# EAGLE design DACBRD (EAGLE 5.07)
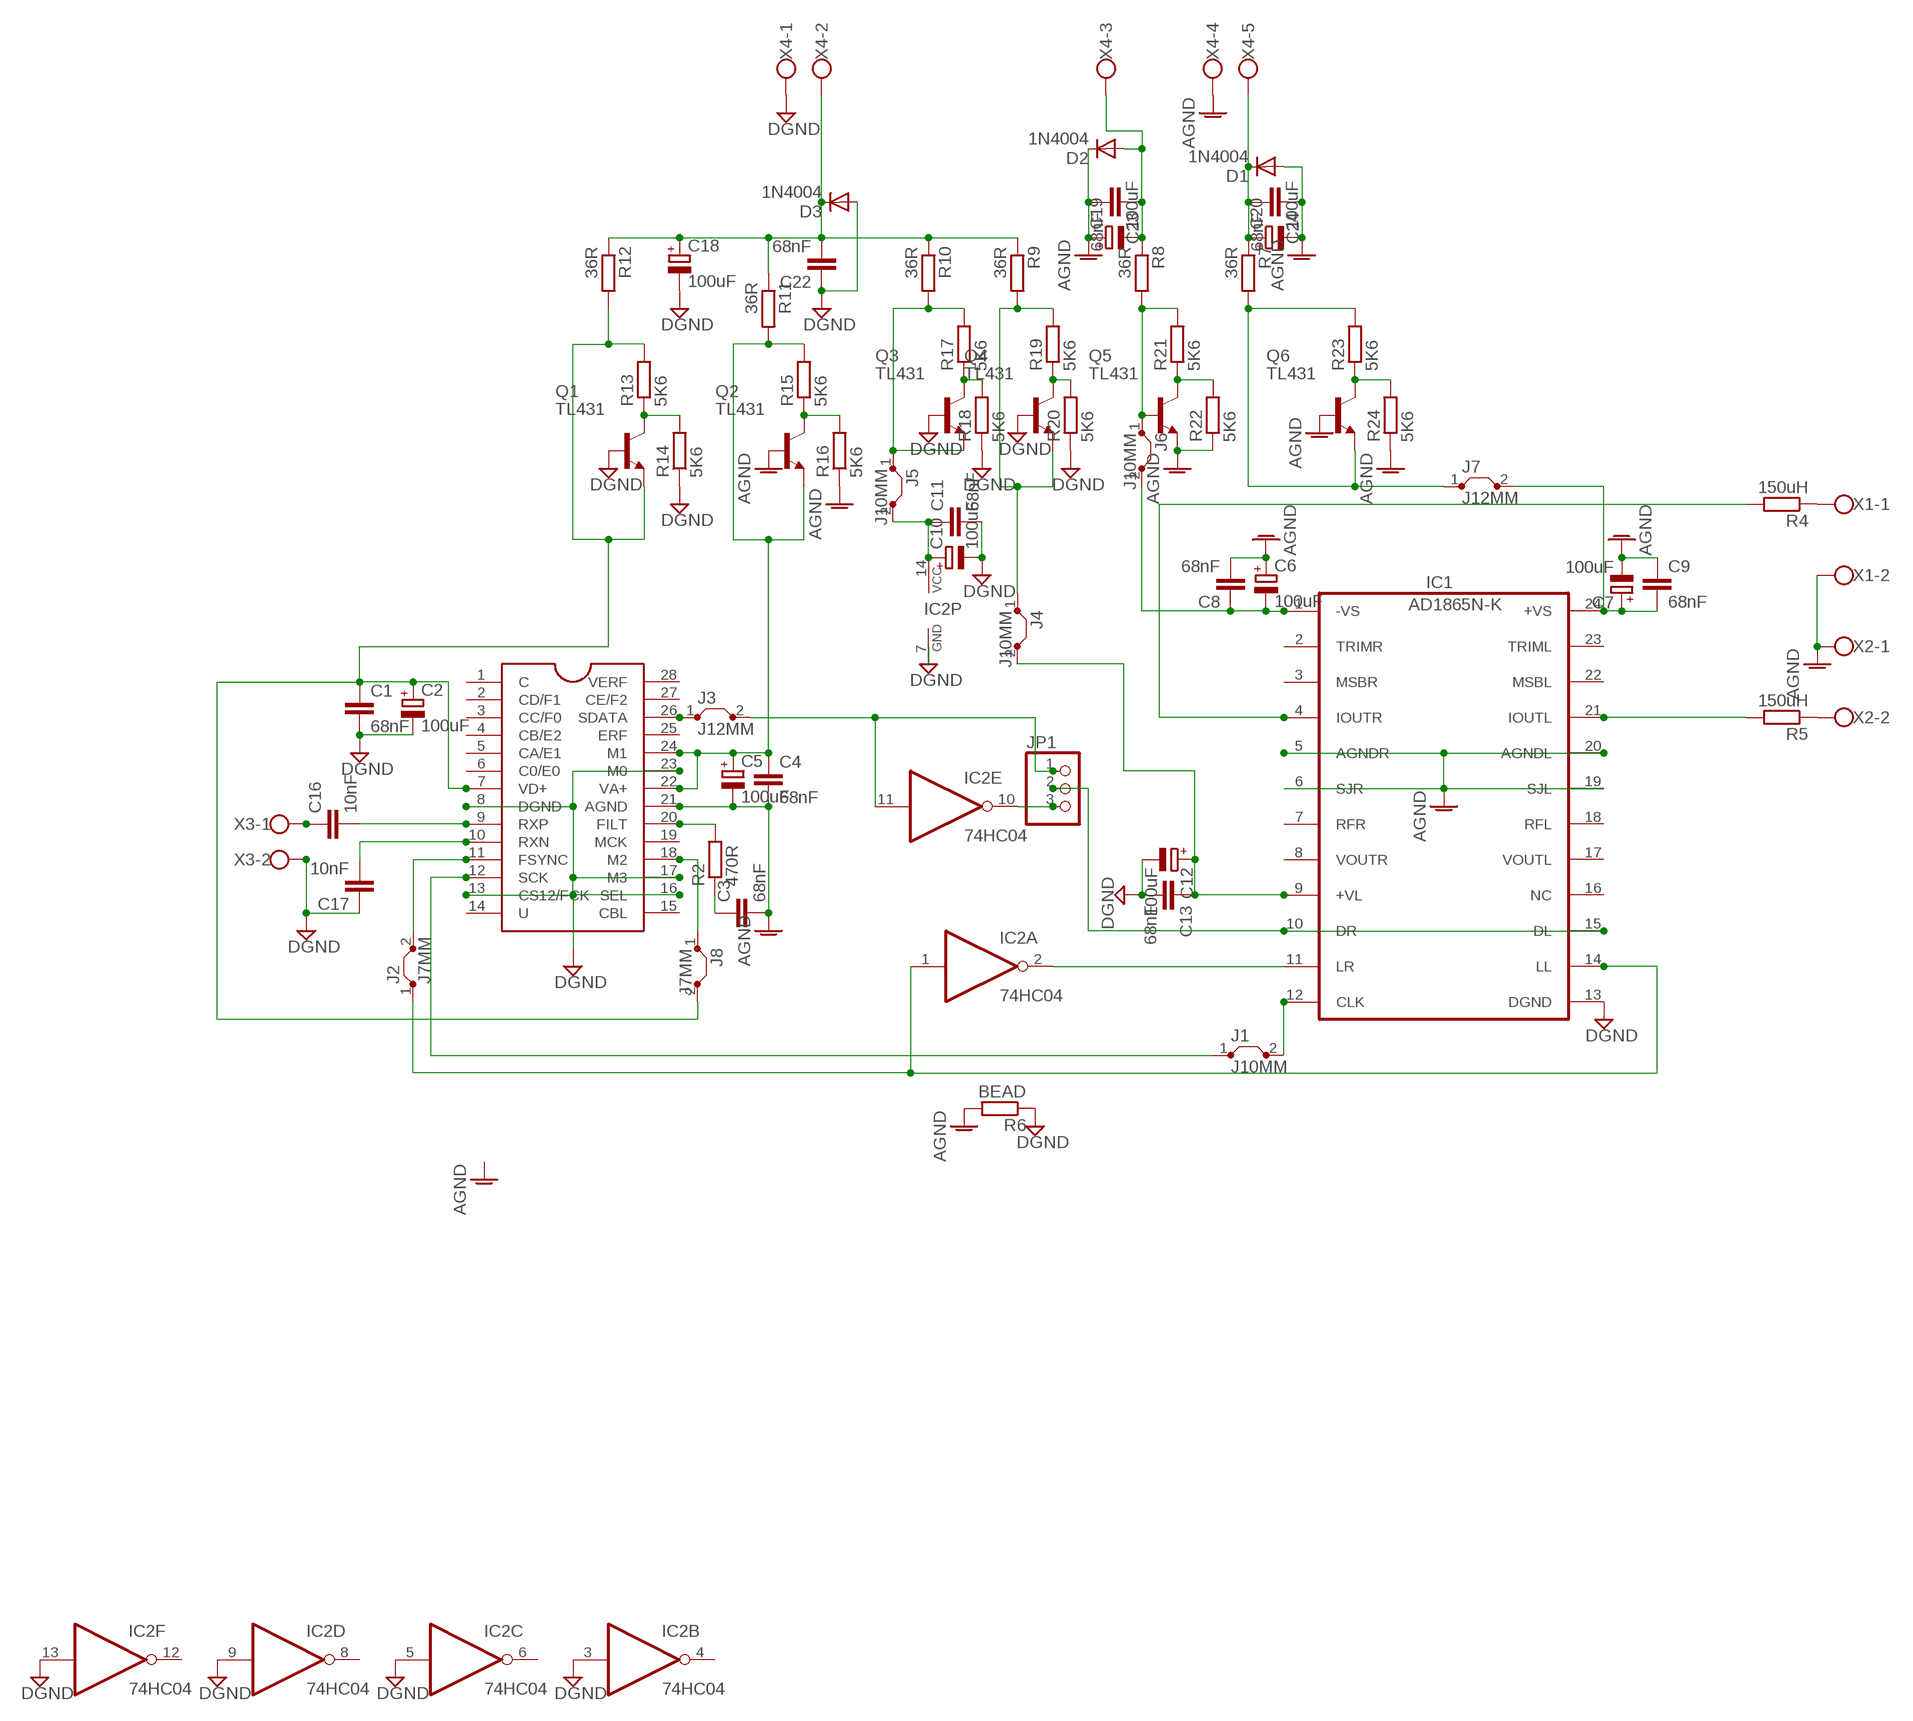
[diagram p0: schematic, sheet 1]

## Parts
C1  68nF  C-EU050-035X075  [C050-035X075]
C2  100uF  CPOL-EUE5-10.5  [E5-10,5]
C3  68nF  C-EU050-075X075  [C050-075X075]
C4  68nF  C-EU050-035X075  [C050-035X075]
C5  100uF  CPOL-EUE5-10.5  [E5-10,5]
C6  100uF  CPOL-EUE5-10.5  [E5-10,5]
C7  100uF  CPOL-EUE5-10.5  [E5-10,5]
C8  68nF  C-EU050-035X075  [C050-035X075]
C9  68nF  C-EU050-035X075  [C050-035X075]
C10  100uF  CPOL-EUE5-10.5  [E5-10,5]
C11  68nF  C-EU050-035X075  [C050-035X075]
C12  100uF  CPOL-EUE5-10.5  [E5-10,5]
C13  68nF  C-EU050-035X075  [C050-035X075]
C16  10nF  C-EU050-055X075  [C050-055X075]
C17  10nF  C-EU050-055X075  [C050-055X075]
C18  100uF  CPOL-EUE5-10.5  [E5-10,5]
C19  100uF  CPOL-EUE5-10.5  [E5-10,5]
C20  100uF  CPOL-EUE5-10.5  [E5-10,5]
C22  68nF  C-EU050-035X075  [C050-035X075]
C23  68nF  C-EU050-035X075  [C050-035X075]
C24  68nF  C-EU050-035X075  [C050-035X075]
D1  1N4004  [DO41-10]
D2  1N4004  [DO41-10]
D3  1N4004  [DO41-10]
IC1  AD1865N-K  AD1865  [DIL24-6]
IC2  74HC04  74HC04N  [DIL14]
J1  J10MM  [10]
J2  J7MM  [07]
J3  J12MM  [12]
J4  J10MM  [10]
J5  J10MM  [10]
J6  J10MM  [10]
J7  J12MM  [12]
J8  J7MM  [07]
JP1  PINHD-1X3  [1X03]
Q1  TL431  BC546A  [TO92-EBC]
Q2  TL431  BC546A  [TO92-EBC]
Q3  TL431  BC546A  [TO92-EBC]
Q4  TL431  BC546A  [TO92-EBC]
Q5  TL431  BC546A  [TO92-EBC]
Q6  TL431  BC546A  [TO92-EBC]
R2  470R  R-EU_0204/7  [0204/7]
R4  150uH  R-EU_0309/12  [0309/12]
R5  150uH  R-EU_0309/12  [0309/12]
R6  BEAD  R-EU_0309/12  [0309/12]
R7  36R  R-EU_0309/12  [0309/12]
R8  36R  R-EU_0309/12  [0309/12]
R9  36R  R-EU_0309/12  [0309/12]
R10  36R  R-EU_0309/12  [0309/12]
R11  36R  R-EU_0309/12  [0309/12]
R12  36R  R-EU_0309/12  [0309/12]
R13  5K6  R-EU_0204/7  [0204/7]
R14  5K6  R-EU_0204/7  [0204/7]
R15  5K6  R-EU_0204/7  [0204/7]
R16  5K6  R-EU_0204/7  [0204/7]
R17  5K6  R-EU_0204/7  [0204/7]
R18  5K6  R-EU_0204/7  [0204/7]
R19  5K6  R-EU_0204/7  [0204/7]
R20  5K6  R-EU_0204/7  [0204/7]
R21  5K6  R-EU_0204/7  [0204/7]
R22  5K6  R-EU_0204/7  [0204/7]
R23  5K6  R-EU_0204/7  [0204/7]
R24  5K6  R-EU_0204/7  [0204/7]
U$1  CS8414  CS8414DIP  [DIL28]
X1  W237-02P  [W237-132]
X2  W237-02P  [W237-132]
X3  W237-02P  [W237-132]
X4  W237-05P  [W237-5P]

## Nets
AGND: C3.2 C4.2 C5.- C6.+ C7.- C8.2 C9.1 C19.+ C20.- C23.2 C24.1 D1.A D2.C IC1.5(AGNDR) IC1.6(SJR) IC1.19(SJL) IC1.20(AGNDL) Q2.B Q5.E Q6.B R6.2 R16.1 R22.1 R24.1 U$1.21(AGND) X1.2 X2.1 X4.4
DGND: C1.2 C2.- C10.- C11.2 C12.- C13.2 C17.1 C18.- C22.1 D3.A IC1.13(DGND) IC2.3(B:I) IC2.5(C:I) IC2.7(P:GND) IC2.9(D:I) IC2.13(F:I) Q1.B Q3.B Q4.B R6.1 R14.1 R18.1 R20.1 U$1.8(DGND) U$1.13(CS12/FCK) U$1.16(SEL) U$1.17(M3) U$1.23(M0) X3.2 X4.1
N$1: R2.2 U$1.20(FILT)
N$2: IC1.10(DR) IC1.15(DL) JP1.2
N$3: C3.1 R2.1
N$5: IC1.11(LR) IC2.2(A:O)
N$6: IC1.14(LL) IC2.1(A:I) J2.1
N$7: J1.1 U$1.12(SCK)
N$8: IC1.12(CLK) J1.2
N$9: J2.2 U$1.11(FSYNC)
N$10: IC2.11(E:I) J3.2 JP1.1
N$11: IC2.10(E:O) JP1.3
N$12: J5.1 Q3.E R10.2 R17.2
N$13: C19.- C23.1 D2.A R8.1 X4.3
N$14: J3.1 U$1.26(SDATA)
N$15: C6.- C8.1 IC1.1(-VS) J6.2
N$16: C7.+ C9.2 IC1.24(+VS) J7.2
N$17: C1.1 C2.+ J8.2 Q1.E R12.2 R13.2 U$1.7(VD+)
N$18: IC1.21(IOUTL) R5.2
N$19: C10.+ C11.1 IC2.14(P:VCC) J5.2
N$20: IC1.4(IOUTR) R4.2
N$21: R5.1 X2.2
N$22: R4.1 X1.1
N$23: C17.2 U$1.10(RXN)
N$24: C16.2 U$1.9(RXP)
N$25: C16.1 X3.1
N$26: C12.+ C13.1 IC1.9(+VL) J4.2
N$27: J7.1 Q6.E R7.2 R23.2
N$28: J6.1 Q5.B R8.2 R21.2
N$29: Q5.C R21.1 R22.2
N$30: J8.1 U$1.18(M2)
N$31: Q1.C R13.1 R14.2
N$32: C4.1 C5.+ Q2.E R11.2 R15.2 U$1.22(VA+) U$1.24(M1)
N$33: Q2.C R15.1 R16.2
N$34: Q3.C R17.1 R18.2
N$36: Q4.C R19.1 R20.2
N$37: Q6.C R23.1 R24.2
N$38: C20.+ C24.2 D1.C R7.1 X4.5
N$39: C18.+ C22.2 D3.C R9.1 R10.1 R11.1 R12.1 X4.2
N$62: J4.1 Q4.E R9.2 R19.2
Unconnected: IC1.2(TRIMR) IC1.3(MSBR) IC1.7(RFR) IC1.8(VOUTR) IC1.16(NC) IC1.17(VOUTL) IC1.18(RFL) IC1.22(MSBL) IC1.23(TRIML) IC2.4(B:O) IC2.6(C:O) IC2.8(D:O) IC2.12(F:O) U$1.1(C) U$1.2(CD/F1) U$1.3(CC/F0) U$1.4(CB/E2) U$1.5(CA/E1) U$1.6(C0/E0) U$1.14(U) U$1.15(CBL) U$1.19(MCK) U$1.25(ERF) U$1.27(CE/F2) U$1.28(VERF)

## Library data of the parts
C1 C3 C4 C8 C9 C11 C13 C16 C17 C22-C24 = resistor:C-EU: CAPACITOR, European symbol
C2 C5-C7 C10 C12 C18-C20 = resistor:CPOL-EU: POLARIZED CAPACITOR, European symbol
D1-D3 = diode:1N4004: DIODE general purpose rectifier, 1 A
IC1 = pavouk:AD1865: Complete Dual 18-Bit 16xFS Audio DAC
IC2 = 74xx-eu:74*04: Hex INVERTER
J1-J8 = jumper:J: Bridge
JP1 = pinhead:PINHD-1X3: PIN HEADER
Q1-Q6 = transistor-npn:BC546*: NPN Transistor
R2 R4-R24 = resistor:R-EU_: RESISTOR, European symbol
U$1 = cirrus-dar:CS8414: 24bit 96kHz Digital Audio Receiver
X1-X3 = con-wago-508:W237-02P: WAGO SREW CLAMP
X4 = con-wago-508:W237-05P: WAGO SREW CLAMP

## Board
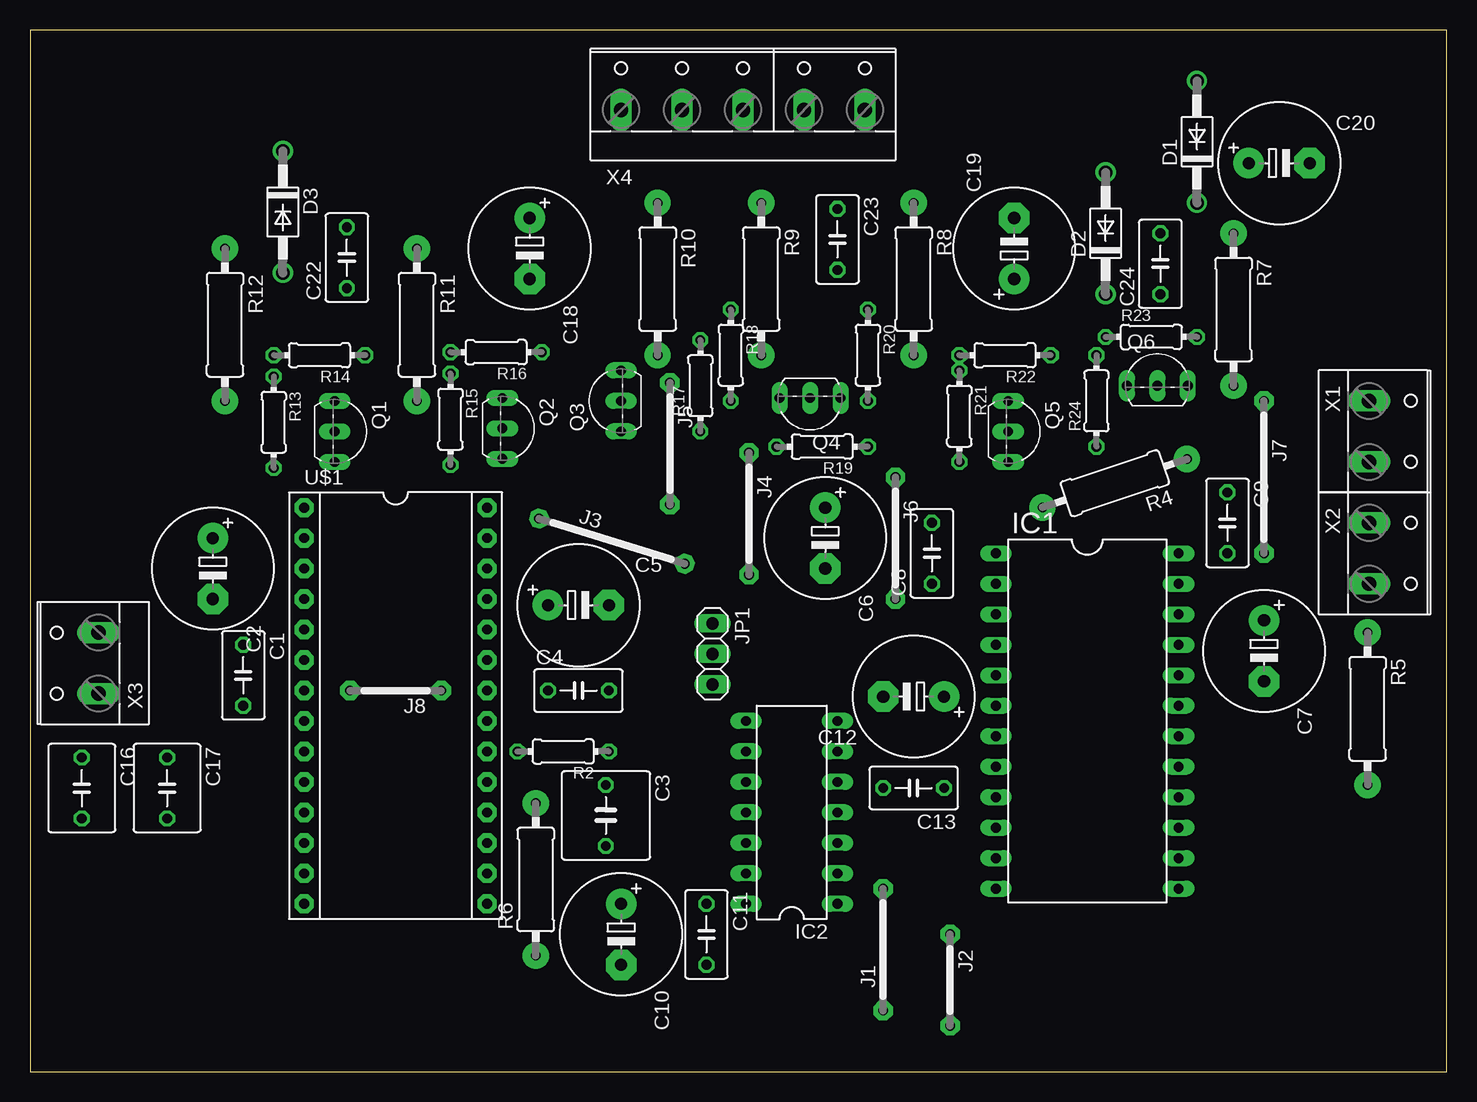
[diagram p1: board, top side]
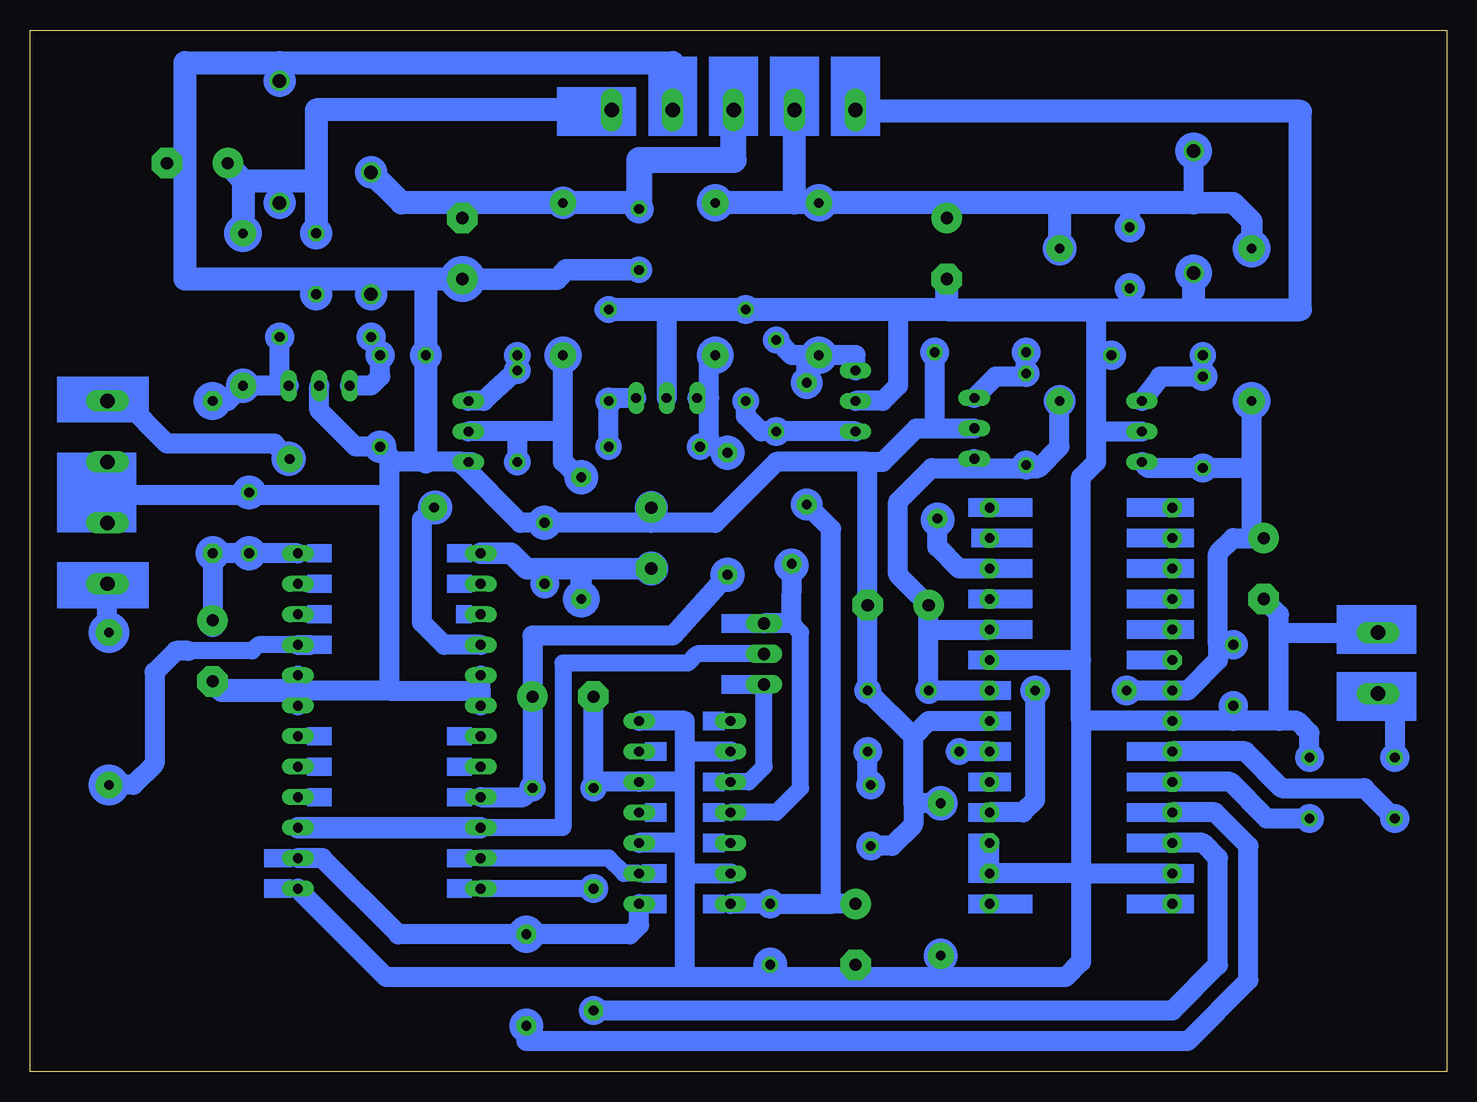
[diagram p2: board, bottom side, seen from below]

Size 118.09 x 86.79 mm. Coordinates in mm from the lower left corner, seen from the top.
Outline: 0,0 118.09,0 118.09,86.79 0,86.79 0,0
Copper layers (1*16): Top 0.035mm / dielectric 1.5mm / Bottom 0.035mm
Design rules "default": minimum track width 10mil, minimum drill 24mil, track to track 8mil, track to pad 8mil, pad to pad 8mil, via to via 8mil, smd to smd 8mil, copper to edge 40mil, drill to drill 8mil, minimum pad ring 10mil, minimum via ring 8mil, stop-mask expansion 4mil, vias tented up to drill 0mil, thermal gap 10mil

### Footprints (pad centres in the part's own frame; a part is rotated, then mirrored left to right if it is on the bottom)
C050-035X075 = drill 0.813 octagon: 1 -2.54,0; 2 2.54,0
E5-10,5 = drill 1.016 pad 2.54 round: + -2.54,0 | drill 1.016 pad 2.54 octagon: - 2.54,0
C050-075X075 = drill 0.813 octagon: 1 -2.54,0; 2 2.54,0
C050-055X075 = drill 0.813 octagon: 1 -2.54,0; 2 2.54,0
DO41-10 = drill 1.118 round: A 5.08,0; C -5.08,0
DIL24-6 = drill 0.813 long: 1 -13.97,-7.62; 2 -11.43,-7.62; 3 -8.89,-7.62; 4 -6.35,-7.62; 5 -3.81,-7.62; 6 -1.27,-7.62; 7 1.27,-7.62; 8 3.81,-7.62; 9 6.35,-7.62; 10 8.89,-7.62; 11 11.43,-7.62; 12 13.97,-7.62; 13 13.97,7.62; 14 11.43,7.62; 15 8.89,7.62; 16 6.35,7.62; 17 3.81,7.62; 18 1.27,7.62; 19 -1.27,7.62; 20 -3.81,7.62; 21 -6.35,7.62; 22 -8.89,7.62; 23 -11.43,7.62; 24 -13.97,7.62
DIL14 = drill 0.813 long: 1 -7.62,-3.81; 2 -5.08,-3.81; 3 -2.54,-3.81; 4 0,-3.81; 5 2.54,-3.81; 6 5.08,-3.81; 7 7.62,-3.81; 8 7.62,3.81; 9 5.08,3.81; 10 2.54,3.81; 11 0,3.81; 12 -2.54,3.81; 13 -5.08,3.81; 14 -7.62,3.81
10 = drill 0.813 pad 1.6 octagon: 1 -5.08,0; 2 5.08,0
07 = drill 0.813 pad 1.6 octagon: 1 -3.81,0; 2 3.81,0
12 = drill 0.813 pad 1.6 octagon: 1 -6.35,0; 2 6.35,0
1X03 = drill 1.016 long: 1 -2.54,0; 2 0,0; 3 2.54,0
TO92-EBC = drill 0.813 long: B 0,-1.27; C -2.54,-1.27; E 2.54,-1.27
0204/7 = drill 0.813 octagon: 1 -3.81,0; 2 3.81,0
0309/12 = drill 0.8 pad 2.184 round: 1 -6.35,0; 2 6.35,0
DIL28 = drill 0.813 pad 1.6 octagon: 1 -16.51,-7.62; 2 -13.97,-7.62; 3 -11.43,-7.62; 4 -8.89,-7.62; 5 -6.35,-7.62; 6 -3.81,-7.62; 7 -1.27,-7.62; 8 1.27,-7.62; 9 3.81,-7.62; 10 6.35,-7.62; 11 8.89,-7.62; 12 11.43,-7.62; 13 13.97,-7.62; 14 16.51,-7.62; 15 16.51,7.62; 16 13.97,7.62; 17 11.43,7.62; 18 8.89,7.62; 19 6.35,7.62; 20 3.81,7.62; 21 1.27,7.62; 22 -1.27,7.62; 23 -3.81,7.62; 24 -6.35,7.62; 25 -8.89,7.62; 26 -11.43,7.62; 27 -13.97,7.62; 28 -16.51,7.62
W237-132 = drill 1.194 long: 1 -2.54,-0.635; 2 2.54,-0.635
W237-5P = drill 1.194 long: 1 -10.16,-0.635; 2 -5.08,-0.635; 3 0,-0.635; 4 5.08,-0.635; 5 10.16,-0.635

### Placement (x,y rotation side)
C1  17.78,33.02 270 top
C2  15.24,41.91 270 top
C3  48.01,21.34 270 top
C4  45.72,31.75 0 top
C5  45.72,38.86 0 top
C6  66.29,44.45 270 top
C7  102.87,35.05 270 top
C8  75.18,43.18 90 top
C9  99.82,45.72 270 top
C10  49.28,11.43 270 top
C11  56.39,11.43 270 top
C12  73.66,31.24 180 top
C13  73.66,23.62 180 top
C16  4.32,23.62 270 top
C17  11.43,23.62 270 top
C18  41.66,68.58 270 top
C19  82.04,68.58 90 top
C20  104.14,75.69 0 top
C22  26.42,67.82 90 top
C23  67.31,69.34 270 top
C24  94.23,67.31 90 top
D1  97.28,77.47 90 top
D2  89.66,69.85 90 top
D3  21.08,71.63 270 top
IC1  88.14,29.21 270 top
IC2  63.5,21.59 90 top
J1  71.12,10.16 90 top
J2  76.71,7.62 270 top
J3  48.51,44.2 342.8 top
J4  59.94,46.48 270 top
J5  53.34,52.32 270 top
J6  72.14,44.45 270 top
J7  102.87,49.53 270 top
J8  30.48,31.75 180 top
JP1  56.9,34.8 270 top
Q1  26.67,53.34 270 top
Q2  40.64,53.59 270 top
Q3  48.01,55.88 90 top
Q4  65.02,54.86 180 top
Q5  82.8,53.34 270 top
Q6  93.98,58.42 0 top
R2  44.45,26.67 180 top
R4  90.42,49.02 198.5 top
R5  111.51,30.23 270 top
R6  42.16,16 90 top
R7  100.33,63.5 270 top
R8  73.66,66.04 270 top
R9  60.96,66.04 270 top
R10  52.32,66.04 270 top
R11  32.26,62.23 270 top
R12  16.26,62.23 270 top
R13  20.32,54.1 270 top
R14  24.13,59.69 180 top
R15  35.05,54.36 270 top
R16  38.86,59.94 180 top
R17  55.88,57.15 90 top
R18  58.42,59.69 270 top
R19  66.04,52.07 180 top
R20  69.85,59.69 270 top
R21  77.47,54.61 270 top
R22  81.28,59.69 180 top
R23  93.47,61.21 0 top
R24  88.9,55.88 90 top
U$1  30.48,30.48 270 top
X1  112.27,53.34 270 top
X2  112.27,43.18 270 top
X3  5.08,34.04 90 top
X4  59.44,80.77 0 top

### Tracks (layer width: path | path; a pad name or v marks a point on that pad's centre or on a via)
AGND
  Bottom 1.676: 80.52,31.75 IC1.6 | 95.76,31.75 IC1.19 | 80.52,31.75 IC1.5 | 88.14,31.75 80.52,31.75 | 88.14,31.75 95.25,31.75 95.76,31.75 | 48.26,50.8 C5.- C4.2 44.45,27.94 | 48.26,50.8 55.88,50.8 60.96,45.72 66.29,45.72 | 85.09,66.04 85.09,65.28 R22.1 | U$1.21 43.18,29.21 44.45,27.94 | 48.26,50.8 46.99,50.8 44.2,53.59 42.67,53.59 | C24.1 94.23,66.04 89.66,66.04 | 85.09,66.04 C19.+ | 85.09,66.04 89.66,66.04 | 42.67,53.59 Q2.B | 42.67,53.59 R16.1 | 81.28,50.8 Q5.E 82.04,50.8 | 82.04,50.8 85.09,50.8 88.14,50.8 | 88.14,50.8 88.14,48.01 | 88.14,48.01 88.14,31.75 | 88.14,50.8 88.14,51.31 R24.1 90.93,52.07 93.98,55.12 Q6.B | 100.58,48.01 C9.1 | 88.14,48.01 100.58,48.01 | 100.58,48.01 111.76,48.01 | 95.76,31.75 IC1.20 | X1.2 X2.1 111.76,45.85 111.76,48.01 | 111.76,48.01 111.76,50.8 | 82.04,50.8 82.04,50.55 77.22,45.72 C8.2 66.29,45.72 | 89.66,66.04 D2.C | 66.29,45.72 C6.+ | C3.2 46.23,18.8 44.45,20.57 44.45,22.35 | 44.45,22.35 44.45,27.94 | R6.2 44.45,22.35
  Bottom 1.778: C23.2 73.41,66.8 74.17,66.04 C19.+
  Bottom 1.93: X4.4 64.52,84.07 97.28,84.07 | 97.28,84.07 105.16,84.07 105.16,75.69 | 105.16,75.69 105.16,66.04 94.23,66.04 C19.+ | 97.28,84.07 D1.A | 85.09,50.8 85.09,65.28 | C7.- 102.11,31.75 95.25,31.75 | 105.16,75.69 C20.-
DGND
  Bottom 1.676: 30.48,34.29 U$1.23 | 30.48,29.21 30.48,16.51 | 30.48,29.21 30.48,34.29 | 30.48,16.51 U$1.16 U$1.17 | 30.48,16.51 U$1.13 | 30.48,29.21 U$1.8 17.78,29.21 | 42.16,7.87 31.75,7.87 30.48,9.14 30.48,16.51 | 42.16,7.87 49.28,7.87 | 49.28,7.87 56.39,7.87 | 56.39,7.87 63.5,7.87 | 49.28,7.87 C10.- | 56.39,7.87 C11.2 | 13.97,29.21 17.78,29.21 | 17.78,29.21 C1.2 | 30.48,34.29 30.48,49.53 29.21,50.8 29.21,53.34 | 13.97,29.21 13.97,36.58 | 71.12,24.13 C12.- | 71.12,24.13 IC2.5 63.5,24.13 | 71.12,24.13 C13.2 | 63.5,16.51 IC2.13 | 63.5,26.67 IC2.9 | 63.5,16.51 63.5,19.05 | 63.5,24.13 63.5,26.67 | 63.5,19.05 63.5,24.13 | 63.5,19.05 IC2.3 | 63.5,7.87 63.5,16.51 | IC2.7 63.5,29.21 63.5,26.67 | 29.21,53.34 29.21,59.69 | 29.21,59.69 29.21,63.5 41.66,63.5 | 29.21,53.34 Q1.B | 29.21,59.69 R14.1 | Q3.B 46.99,55.88 45.72,57.15 45.72,63.5 R18.1 58.67,63.5 65.02,63.5 | 65.02,63.5 Q4.B | 65.02,63.5 69.34,63.5 | 63.5,7.87 88.39,7.87 IC1.13 | 13.97,36.58 X3.2 | C17.1 11.43,28.19 12.45,29.21 13.97,29.21 | 42.16,7.87 R6.1 | C2.- 13.97,38.1 13.97,36.58
  Bottom 1.778: 26.42,63.5 C22.1
  Bottom 1.93: X4.1 49.28,80.01 12.19,80.01 12.19,63.5 21.08,63.5 | 41.66,63.5 26.42,63.5 21.08,63.5 | 41.66,63.5 45.72,63.5 58.67,63.5 69.34,63.5 R20.1 70.1,63.5 | 21.08,63.5 D3.A | 41.66,63.5 C18.-
N$1
  Bottom 1.676: U$1.20 R2.2
N$2
  Bottom 1.422: IC1.10 73.66,20.32 73.66,34.04 63.25,34.04 62.48,34.8 JP1.2
  Bottom 1.778: IC1.10 IC1.15
N$3
  Bottom 1.676: C3.1 48.26,24.13 R2.1
N$5
  Bottom 1.422: IC2.2 68.58,16.51 69.85,17.78 IC1.11
N$6
  Bottom 1.676: IC2.1 67.31,12.19 68.07,11.43 J2.1 87.38,11.43 93.73,17.78 IC1.14
N$7
  Bottom 1.676: J1.1 22.86,5.08 19.05,8.89 19.05,17.78 20.32,19.05 U$1.12
N$8
  Bottom 1.422: J1.2 IC1.12
N$9
  Bottom 1.676: J2.2 76.71,2.54 21.59,2.54 16.51,7.62 16.51,18.8 19.3,21.59 U$1.11
N$10
  Bottom 1.422: 54.61,37.34 53.85,36.58 53.85,23.62 55.88,21.59 IC2.11
  Bottom 1.676: J3.2 54.61,37.34 JP1.1
N$11
  Bottom 1.422: JP1.3 56.9,25.4 58.17,24.13 IC2.10
N$12
  Bottom 1.676: R10.2 51.82,59.69 49.28,59.69 Q3.E | R17.2 54.61,59.69 53.34,59.69
  Bottom 1.778: J5.1 53.34,59.69 51.82,59.69
N$13
  Bottom 1.676: 74.17,72.39 R8.1
  Bottom 1.93: 67.31,72.39 74.17,72.39 82.04,72.39 | 88.65,73.91 D2.A 87.12,72.39 82.04,72.39 | 82.04,72.39 C19.-
  Bottom 2.184: X4.3 59.44,75.95 67.31,75.95 67.31,72.39 C23.1
N$14
  Bottom 1.676: U$1.26 40.64,41.91 42.45,43.72 J3.1
N$15
  Bottom 1.778: IC1.1 77.98,43.18 76.71,41.91 75.18,41.91 | C6.- 72.14,41.91 | 72.14,41.91 75.18,41.91 | 72.14,41.91 J6.2 | 75.18,41.91 C8.1
N$16
  Bottom 1.676: IC1.24 C9.2 J7.2 C7.+
N$17
  Bottom 1.676: J8.2 U$1.7 21.59,31.75 19.05,34.29 19.05,35.56 | Q1.E 24.89,50.29 R13.2 16.26,50.29 | 16.26,44.45 17.78,44.45 19.05,43.18 19.05,35.56 | 16.26,44.45 C2.+ | C1.1 19.05,35.56 | 16.26,44.45 16.26,50.29 | 16.26,50.29 R12.2
N$18
  Bottom 1.422: IC1.21 99.06,35.56 99.57,35.05 104.9,35.05
  Bottom 1.676: IC1.21 94.74,35.56 | 104.9,35.05 105.92,35.05 107.7,33.27 107.7,25.65 109.47,23.88 R5.2
N$19
  Bottom 1.676: IC2.14 C11.1 51.31,13.97 | 51.31,13.97 51.31,45.21 J5.2 | C10.+ 51.31,13.97
N$20
  Bottom 1.676: IC1.4 83.57,35.56 85.42,37.41 85.42,45.99 R4.2
N$21
  Bottom 1.676: R5.1 111.63,36.96 X2.2
N$22
  Bottom 1.676: R4.1 97.73,52.32 106.68,52.32 110.24,55.88 X1.1
N$23
  Bottom 1.676: U$1.10 18.03,24.13 14.99,21.08 C17.2
N$24
  Bottom 1.676: U$1.9 16.76,26.67 13.72,23.62 6.86,23.62 C16.2
N$25
  Bottom 1.676: X3.1 4.32,30.1 C16.1
N$26
  Bottom 1.676: J4.2 64.52,36.32 76.2,36.32 C12.+ C13.1 76.96,22.86 IC1.9
N$27
  Bottom 1.676: 97.28,57.15 R23.2 | 97.28,57.15 R7.2 101.6,55.88 J7.1 | Q6.E 97.28,57.15
N$28
  Bottom 1.676: 73.66,53.34 77.47,53.34 | 73.66,53.34 R8.2 | J6.1 72.39,49.53 73.66,50.8 73.66,53.34 | 77.47,53.34 R21.2 | 77.47,53.34 Q5.B
N$29
  Bottom 1.676: R22.2 R21.1 80.26,55.88 Q5.C
N$30
  Bottom 1.676: J8.1 34.29,22.61 35.31,21.59 U$1.18
N$31
  Bottom 1.676: R14.2 R13.1 23.88,57.91 Q1.C
N$32
  Bottom 1.676: U$1.22 C4.1 43.18,36.83 | 43.18,36.83 C5.+ 45.72,41.4 45.72,47.5 42.93,50.29 39.62,50.29 | 43.18,36.83 U$1.24 | R11.2 32.26,52.07 34.04,50.29 35.31,50.29 | 35.31,50.29 R15.2 | 39.62,50.29 35.56,50.29 35.31,50.29 | 39.62,50.29 Q2.E
N$33
  Bottom 1.676: R16.2 R15.1 35.31,57.91 37.59,57.91 Q2.C
N$34
  Bottom 1.676: Q3.C R17.1 57.15,53.34 58.42,54.61 R18.2
N$36
  Bottom 1.676: R19.1 R20.2 69.85,56.13 Q4.C
N$37
  Bottom 1.676: Q6.C 89.66,57.15 88.9,57.91 R24.2 R23.1
N$38
  Bottom 1.93: X4.5 94.23,80.14 94.23,74.17 | 100.33,74.17 C20.+ | 94.23,74.17 97.28,74.17 | 97.28,74.17 100.33,74.17 | 97.28,74.17 D1.C | 100.33,74.17 R7.1 | 94.23,74.17 C24.2
N$39
  Bottom 1.676: 26.42,72.39 C22.2 | 52.83,72.39 R10.1 | 21.08,72.39 D3.C
  Bottom 1.778: R12.1 16.26,70.87 17.78,72.39 21.08,72.39
  Bottom 1.93: 54.36,72.39 X4.2 | 21.08,72.39 26.42,72.39 32.26,72.39 | 54.36,72.39 R9.1 | 32.26,72.39 41.66,72.39 | 41.66,72.39 52.83,72.39 54.36,72.39 | 32.26,72.39 R11.1 | 41.66,72.39 C18.+
N$62
  Bottom 1.676: R9.2 61.47,59.18 61.47,56.13 | 61.47,52.83 61.47,52.58 60.45,51.56 J4.1 | 61.47,52.83 R19.2 | 61.47,52.83 61.47,56.13 | 61.47,56.13 Q4.E
(copper drawn outside any net)
  shapes: Bottom area x87, Bottom circle x124